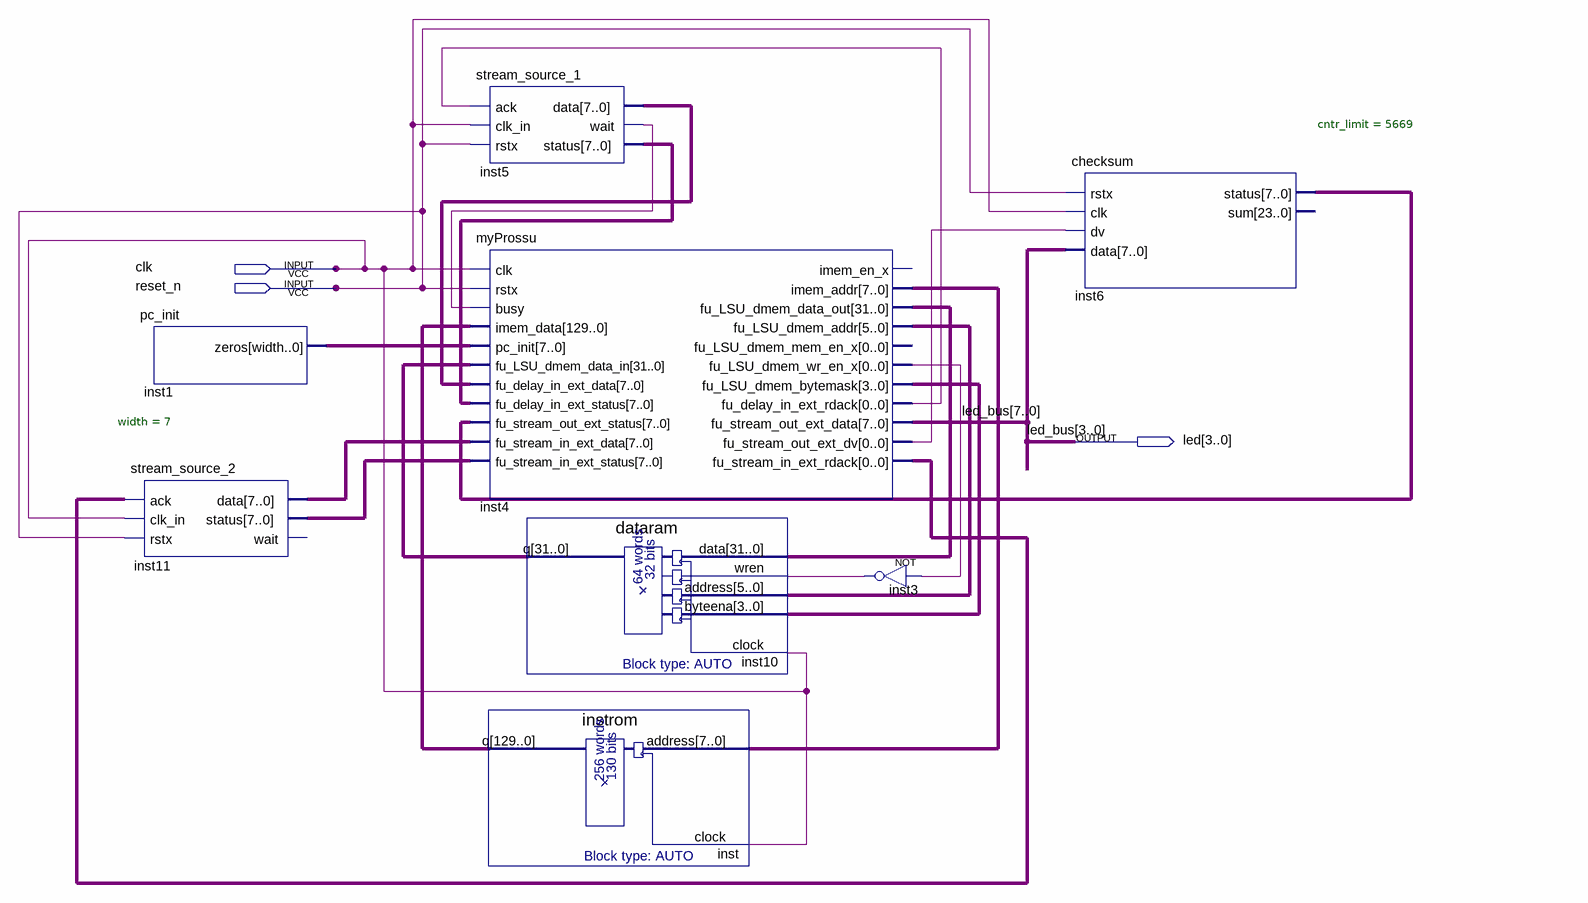
[diagram p0: schematic sheet]
// Quartus schematic tta_farrowV3.bdf as structural Verilog: 8 symbols, 3 pins
module tta_farrowV3 (
  input  clk,
  input  reset_n,
  output [3:0] led
);

  wire inst3_out, inst4_fu_delay_in_ext_rdack, inst4_fu_lsu_dmem_wr_en_x, inst4_fu_stream_in_ext_rdack,
       inst4_fu_stream_out_ext_dv, inst5_wait;
  wire [3:0] inst4_fu_lsu_dmem_bytemask;
  wire [5:0] inst4_fu_lsu_dmem_addr;
  wire [7:0] inst1_zeros, inst4_imem_addr, inst5_data, inst5_status, inst6_status, inst11_data, inst11_status;
  wire [7:4] led_bus;
  wire [31:0] inst4_fu_lsu_dmem_data_out, inst10_q;
  wire [129:0] inst_q;

  pc_init #(.width(7)) inst1 (.zeros(inst1_zeros));
  stream_source_2 inst11 (
    .ack(inst4_fu_stream_in_ext_rdack), .clk_in(clk), .rstx(reset_n), .data(inst11_data),
    .status(inst11_status));  // open: wait
  stream_source_1 inst5 (
    .ack(inst4_fu_delay_in_ext_rdack), .clk_in(clk), .rstx(reset_n), .data(inst5_data), .\wait (inst5_wait),
    .status(inst5_status));
  myProssu inst4 (
    .clk(clk), .rstx(reset_n), .busy(inst5_wait), .imem_data(inst_q), .pc_init(inst1_zeros),
    .fu_LSU_dmem_data_in(inst10_q), .fu_delay_in_ext_data(inst5_data), .fu_delay_in_ext_status(inst5_status),
    .fu_stream_out_ext_status(inst6_status), .fu_stream_in_ext_data(inst11_data),
    .fu_stream_in_ext_status(inst11_status), .imem_addr(inst4_imem_addr),
    .fu_LSU_dmem_data_out(inst4_fu_lsu_dmem_data_out), .fu_LSU_dmem_addr(inst4_fu_lsu_dmem_addr),
    .fu_LSU_dmem_wr_en_x(inst4_fu_lsu_dmem_wr_en_x), .fu_LSU_dmem_bytemask(inst4_fu_lsu_dmem_bytemask),
    .fu_delay_in_ext_rdack(inst4_fu_delay_in_ext_rdack), .fu_stream_out_ext_data({led_bus, led}),
    .fu_stream_out_ext_dv(inst4_fu_stream_out_ext_dv), .fu_stream_in_ext_rdack(inst4_fu_stream_in_ext_rdack));  // open: imem_en_x, fu_LSU_dmem_mem_en_x
  instrom inst (.address(inst4_imem_addr), .clock(clk), .q(inst_q));
  dataram inst10 (
    .data(inst4_fu_lsu_dmem_data_out), .wren(inst3_out), .address(inst4_fu_lsu_dmem_addr),
    .byteena(inst4_fu_lsu_dmem_bytemask), .clock(clk), .q(inst10_q));
  not inst3 (inst3_out, inst4_fu_lsu_dmem_wr_en_x);
  checksum #(.cntr_limit(5669)) inst6 (
    .rstx(reset_n), .clk(clk), .dv(inst4_fu_stream_out_ext_dv), .data({led_bus, led}), .status(inst6_status));  // open: sum

  // Other names for the same wires on the sheet: led_bus[3:0] = led
endmodule
